# EAGLE schematic 8 steps sequencer (EAGLE 7.4.0)
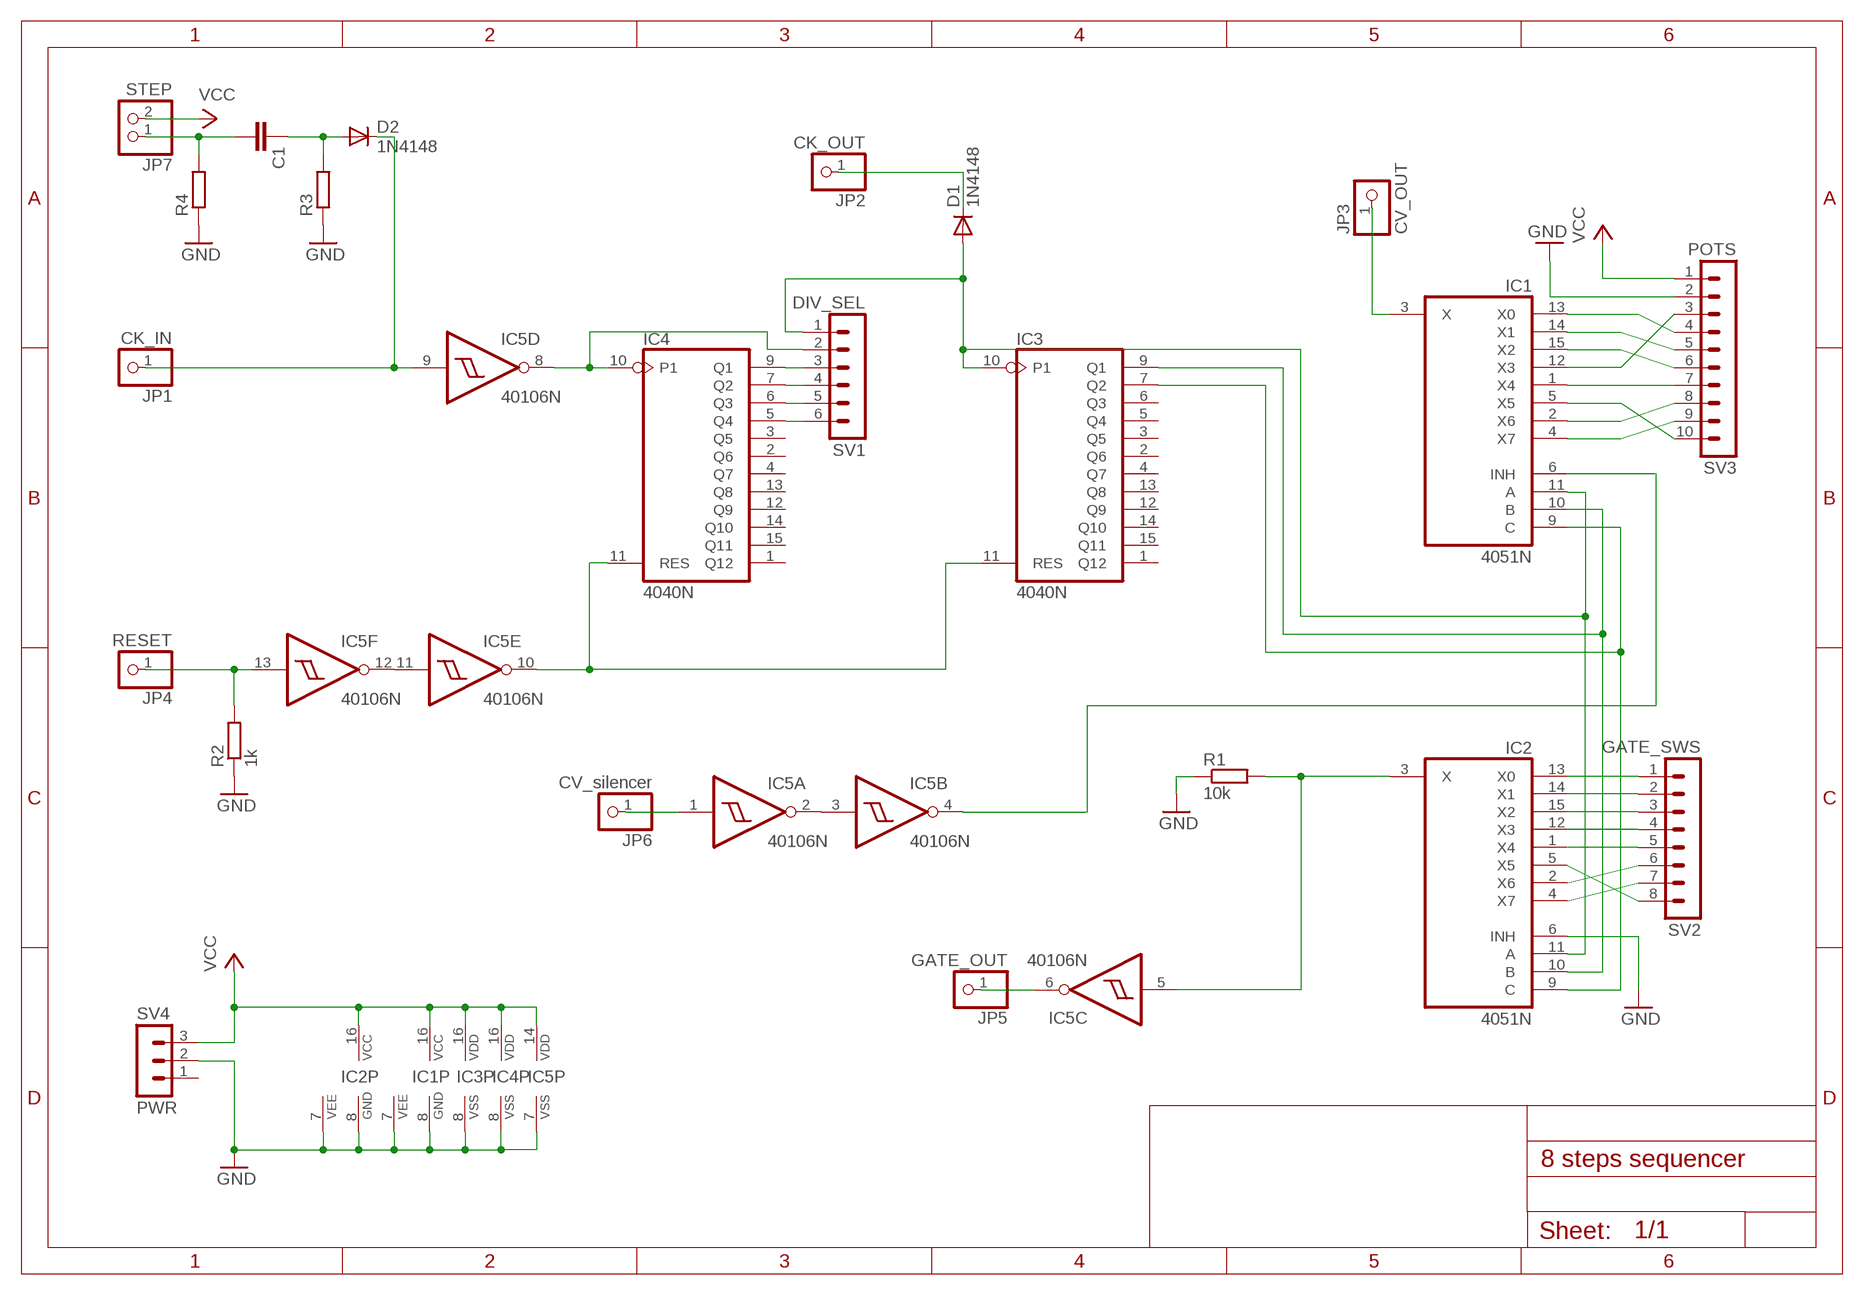
[diagram p0: schematic, sheet 1]

## Parts
C1  C-EU025-030X050  [C025-030X050]
D1  1N4148  DIODE-D-2.5  [D-2.5]
D2  1N4148  DIODE-D-2.5  [D-2.5]
IC1  4051N  [DIL16]
IC2  4051N  [DIL16]
IC3  4040N  [DIL16]
IC4  4040N  [DIL16]
IC5  40106N  [DIL14]
JP1  CK_IN  PINHD-1X1  [1X01]
JP2  CK_OUT  PINHD-1X1  [1X01]
JP3  CV_OUT  PINHD-1X1  [1X01]
JP4  RESET  PINHD-1X1  [1X01]
JP5  GATE_OUT  PINHD-1X1  [1X01]
JP6  CV_silencer  PINHD-1X1  [1X01]
JP7  STEP  PINHD-1X2  [1X02]
R1  10k  R-EU_0204/2V  [0204V]
R2  1k  R-EU_0204/2V  [0204V]
R3  R-EU_0204/2V  [0204V]
R4  R-EU_0204/2V  [0204V]
SV1  DIV_SEL  MA06-1  [MA06-1]
SV2  GATE_SWS  MA08-1  [MA08-1]
SV3  POTS  MA10-1  [MA10-1]
SV4  PWR  MA03-1  [MA03-1]

## Nets
GND: IC1.7(VEE) IC1.8(GND) IC2.6(INH) IC2.7(VEE) IC2.8(GND) IC3.8(VSS) IC4.8(VSS) IC5.7(P:VSS) R1.1 R2.1 R3.1 R4.1 SV3.2 SV4.2
N$1: D2.C IC5.9(D:I) JP1.1
N$2: IC4.10(P1) IC5.8(D:O) SV1.2
N$3: IC4.9(Q1) SV1.3
N$4: IC4.7(Q2) SV1.4
N$5: IC4.6(Q3) SV1.5
N$6: IC4.5(Q4) SV1.6
N$7: IC2.13(X0) SV2.1
N$8: D1.A IC1.11(A) IC2.11(A) IC3.10(P1) SV1.1
N$9: IC1.10(B) IC2.10(B) IC3.9(Q1)
N$10: IC1.9(C) IC2.9(C) IC3.7(Q2)
N$11: IC2.14(X1) SV2.2
N$12: IC2.15(X2) SV2.3
N$13: IC2.12(X3) SV2.4
N$14: IC2.1(X4) SV2.5
N$15: IC2.5(X5) SV2.8
N$16: IC2.2(X6) SV2.6
N$17: IC2.4(X7) SV2.7
N$18: IC1.1(X4) SV3.7
N$19: IC1.2(X6) SV3.8
N$20: IC1.4(X7) SV3.9
N$21: IC1.5(X5) SV3.10
N$22: IC1.15(X2) SV3.6
N$23: IC1.14(X1) SV3.5
N$24: IC1.13(X0) SV3.4
N$25: IC1.12(X3) SV3.3
N$26: IC1.3(X) JP3.1
N$27: IC5.11(E:I) IC5.12(F:O)
N$28: IC5.13(F:I) JP4.1 R2.2
N$29: IC2.3(X) IC5.5(C:I) R1.2
N$30: D1.C JP2.1
N$32: IC5.2(A:O) IC5.3(B:I)
N$33: IC5.6(C:O) JP5.1
N$34: IC5.1(A:I) JP6.1
N$35: IC1.6(INH) IC5.4(B:O)
N$36: C1.2 JP7.1 R4.2
N$38: C1.1 D2.A R3.2
N$39: IC3.11(RES) IC4.11(RES) IC5.10(E:O)
VCC: IC1.16(VCC) IC2.16(VCC) IC3.16(VDD) IC4.16(VDD) IC5.14(P:VDD) JP7.2 SV3.1 SV4.3
Unconnected: IC3.1(Q12) IC3.2(Q6) IC3.3(Q5) IC3.4(Q7) IC3.5(Q4) IC3.6(Q3) IC3.12(Q9) IC3.13(Q8) IC3.14(Q10) IC3.15(Q11) IC4.1(Q12) IC4.2(Q6) IC4.3(Q5) IC4.4(Q7) IC4.12(Q9) IC4.13(Q8) IC4.14(Q10) IC4.15(Q11) SV4.1

## Library data of the parts
C1 = rcl:C-EU: CAPACITOR, European symbol
D1 D2 = diode:DIODE-: DIODE
IC1 IC2 = 40xx:4051: 8-channel ANALOG MULTIPLEXER
IC3 IC4 = 40xx:4040: 12-stage binary/ripple COUNTER
IC5 = 40xx:40106: Hex SCHMITT TRIGGER
JP1-JP6 = pinhead:PINHD-1X1: PIN HEADER
JP7 = pinhead:PINHD-1X2: PIN HEADER
R1-R4 = rcl:R-EU_: RESISTOR, European symbol
SV1 = con-lstb:MA06-1: PIN HEADER; OC_FARNELL: unknown; OC_NEWARK: unknown
SV2 = con-lstb:MA08-1: PIN HEADER; OC_FARNELL: unknown; OC_NEWARK: unknown
SV3 = con-lstb:MA10-1: PIN HEADER; OC_FARNELL: unknown; OC_NEWARK: unknown
SV4 = con-lstb:MA03-1: PIN HEADER; OC_FARNELL: unknown; OC_NEWARK: unknown